# EAGLE design board (EAGLE 8.0.0)
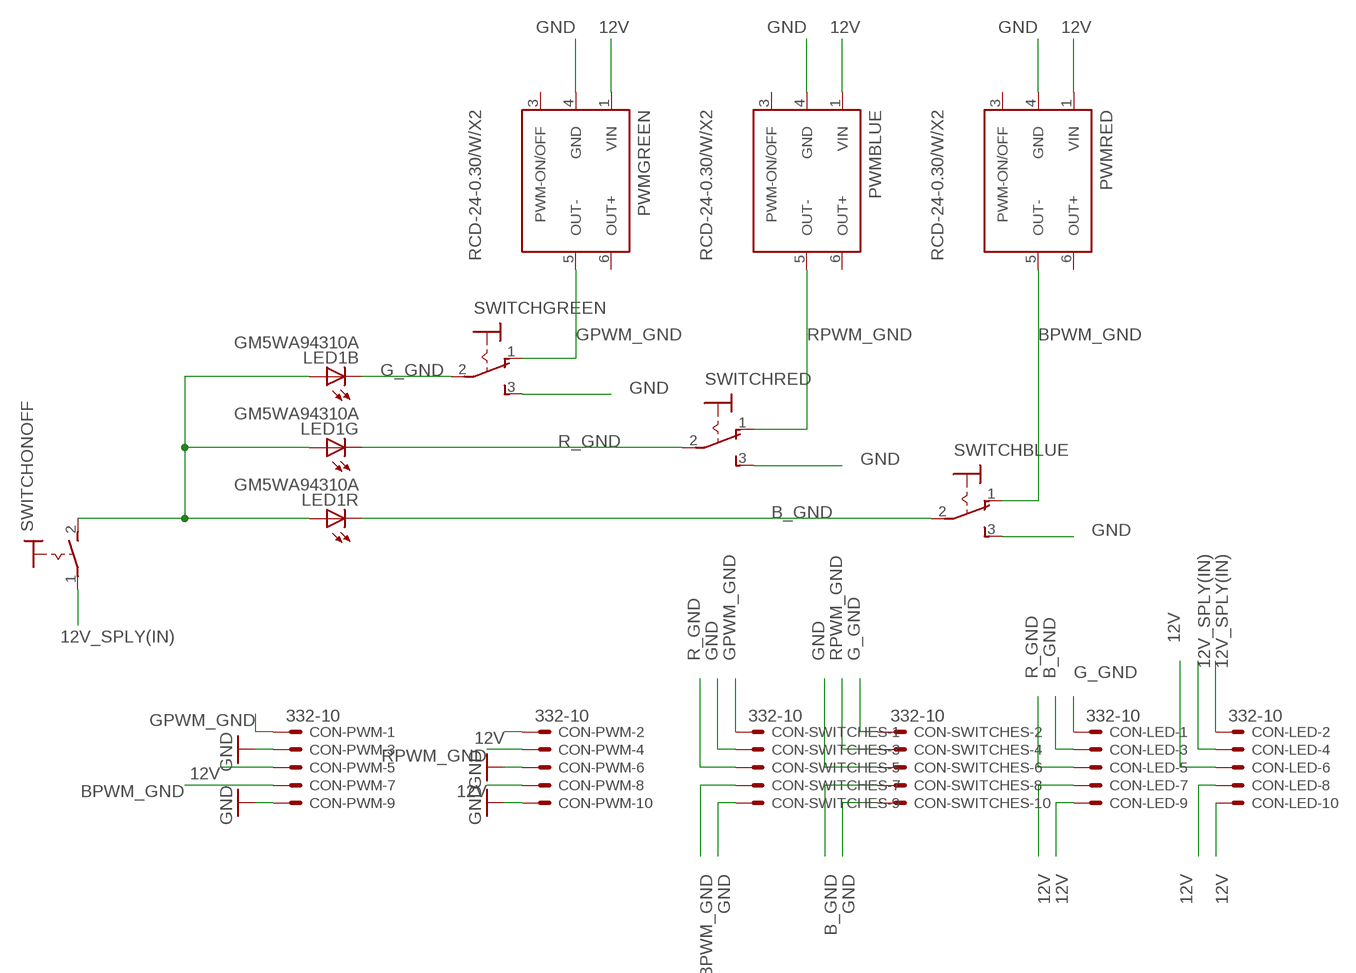
[diagram p0: schematic, sheet 1]

## Parts
CON-LED  332-10  [332-10]
CON-PWM  332-10  [332-10]
CON-SWITCHES  332-10  [332-10]
LED1  GM5WA94310A  [GM5WA94310A]
PWMBLUE  RCD-24-0.30/W/X2  [RCD-24/W/X2]
PWMGREEN  RCD-24-0.30/W/X2  [RCD-24/W/X2]
PWMRED  RCD-24-0.30/W/X2  [RCD-24/W/X2]
SWITCHBLUE  M9040P  [M9040P]
SWITCHGREEN  M9040P  [M9040P]
SWITCHONOFF  MS243  [MS243]
SWITCHRED  M9040P  [M9040P]

## Nets
12V: CON-LED.6 CON-LED.7 CON-LED.8 CON-LED.9 CON-LED.10 CON-PWM.2 CON-PWM.5 CON-PWM.8 LED1.1(B:A) LED1.2(R:A) LED1.3(G:A) PWMBLUE.1(VIN) PWMGREEN.1(VIN) PWMRED.1(VIN) SWITCHONOFF.2(S)
12V_SPLY(IN): CON-LED.2 CON-LED.4 SWITCHONOFF.1(P)
B_GND: CON-LED.3 CON-SWITCHES.8 LED1.5(R:C) SWITCHBLUE.2(P)
BPWM_GND: CON-PWM.7 CON-SWITCHES.7 PWMRED.5(OUT-) SWITCHBLUE.1(O)
G_GND: CON-LED.1 CON-SWITCHES.2 LED1.6(B:C) SWITCHGREEN.2(P)
GND: CON-PWM.3 CON-PWM.6 CON-PWM.9 CON-PWM.10 CON-SWITCHES.3 CON-SWITCHES.6 CON-SWITCHES.9 CON-SWITCHES.10 PWMBLUE.4(GND) PWMGREEN.4(GND) PWMRED.4(GND) SWITCHBLUE.3(S) SWITCHGREEN.3(S) SWITCHRED.3(S)
GPWM_GND: CON-PWM.1 CON-SWITCHES.1 PWMGREEN.5(OUT-) SWITCHGREEN.1(O)
R_GND: CON-LED.5 CON-SWITCHES.5 LED1.4(G:C) SWITCHRED.2(P)
RPWM_GND: CON-PWM.4 CON-SWITCHES.4 PWMBLUE.5(OUT-) SWITCHRED.1(O)
Unconnected: PWMBLUE.3(PWM-ON/OFF) PWMBLUE.6(OUT+) PWMGREEN.3(PWM-ON/OFF) PWMGREEN.6(OUT+) PWMRED.3(PWM-ON/OFF) PWMRED.6(OUT+)

## Library data of the parts
CON-LED CON-PWM CON-SWITCHES = con-garry:332-10: 10 Pin - 2mm Dual Row Source: www.mpe-connector.de / garry_shortform_2012.pdf
LED1 = led:GM5WA94310A: Chip LED RGB Source: http://document.sharpsma.com/files/GM5WA94310A_SS.pdf
PWMBLUE PWMGREEN PWMRED = recom-international:RCD-24*/W/X2: Constant Current Output LED Driver PWM ON/OFF Source: http://www.recom-international.de/pdf/Innoline/RCD-24.pdf; OC_FARNELL: unknown; OC_NEWARK: unknown
SWITCHBLUE SWITCHGREEN SWITCHRED = switch:M9040P: TOGGLE SWITCH Marquardt
SWITCHONOFF = switch:MS243: TOGGLE SWITCH

## Board
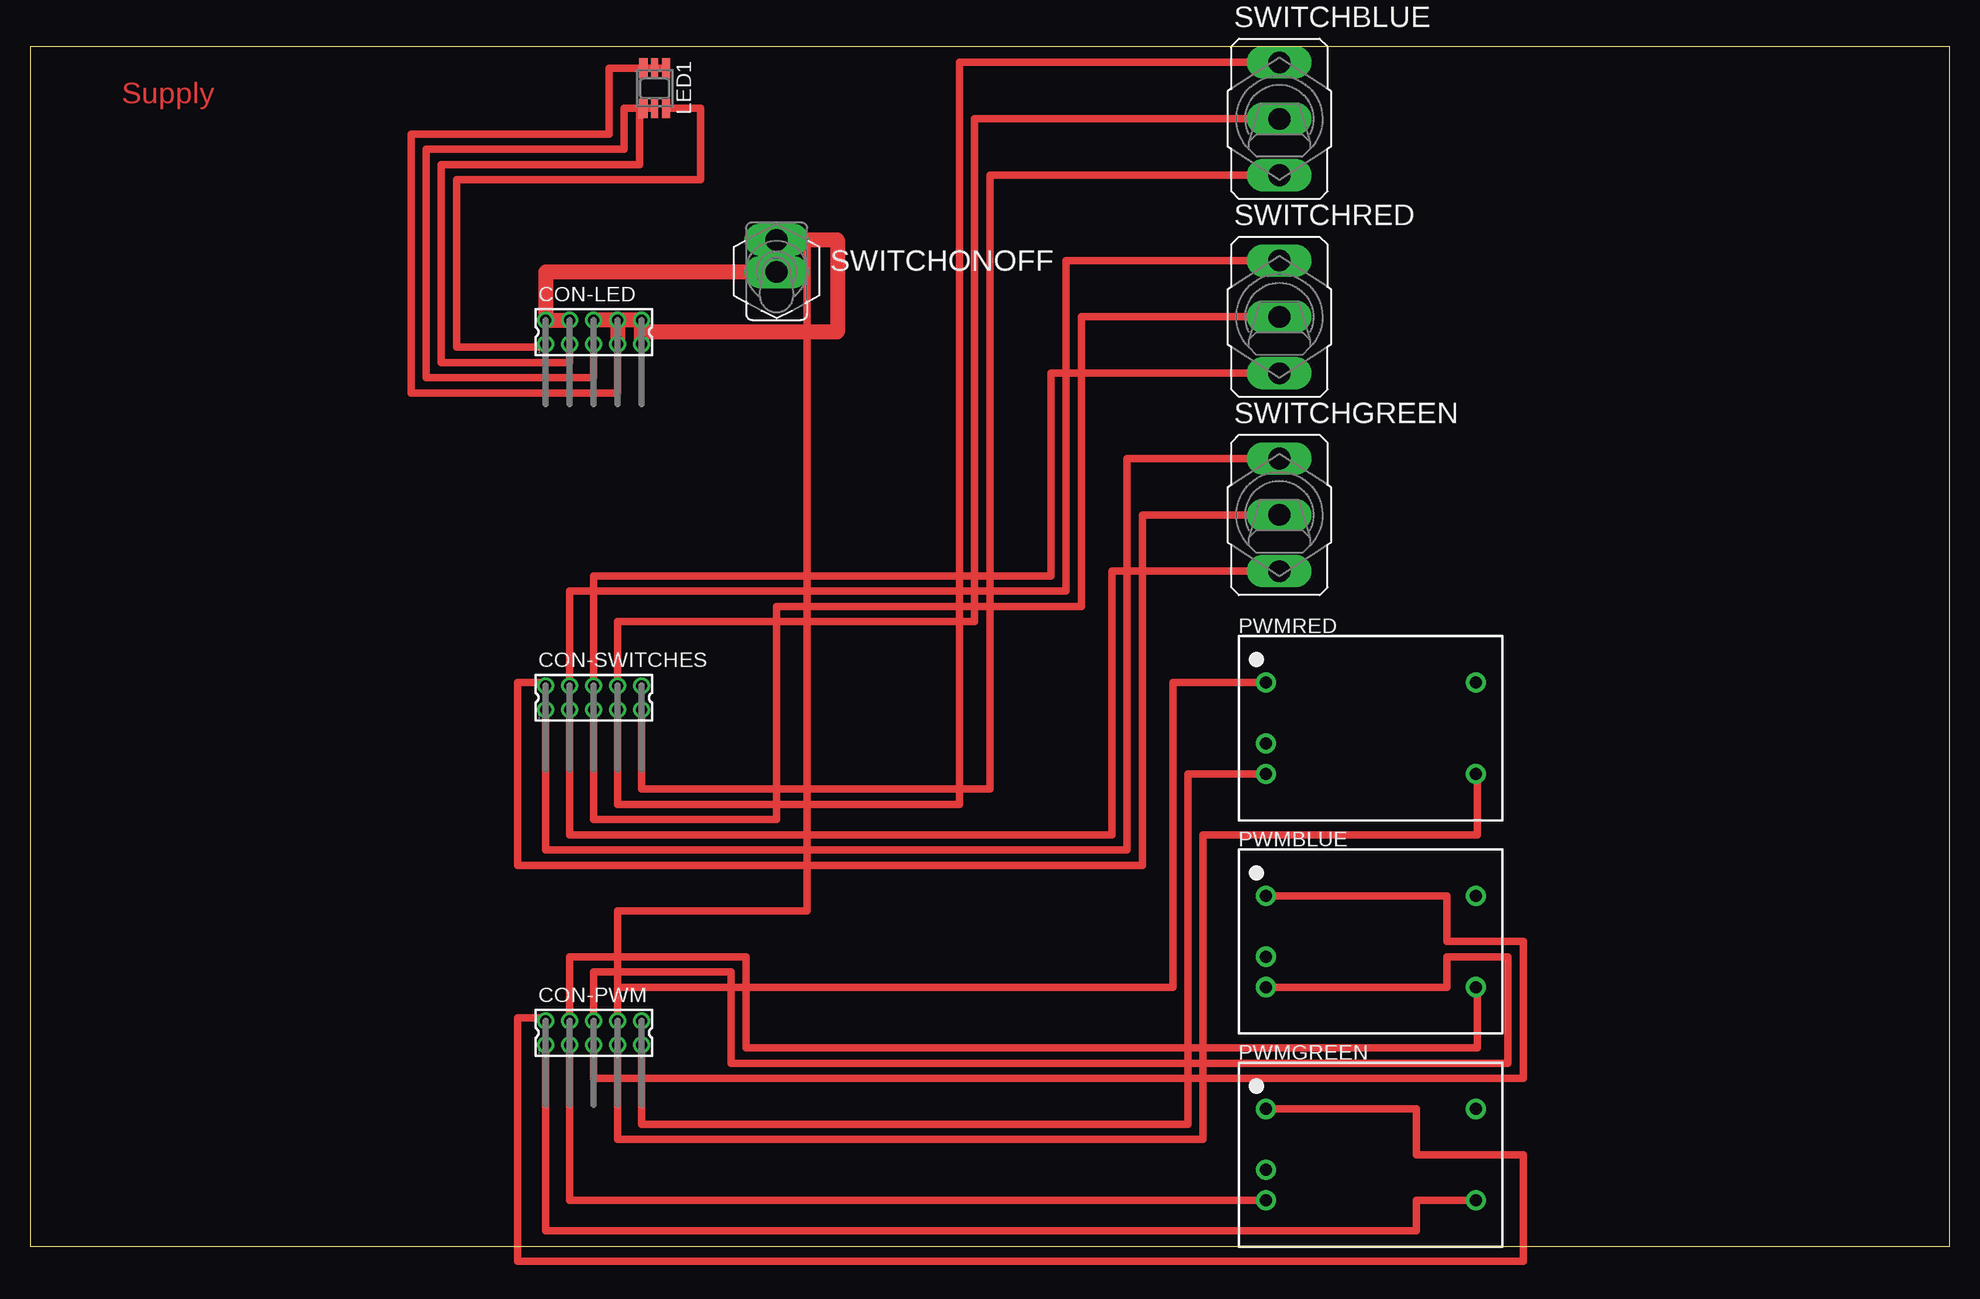
[diagram p1: board, top side]
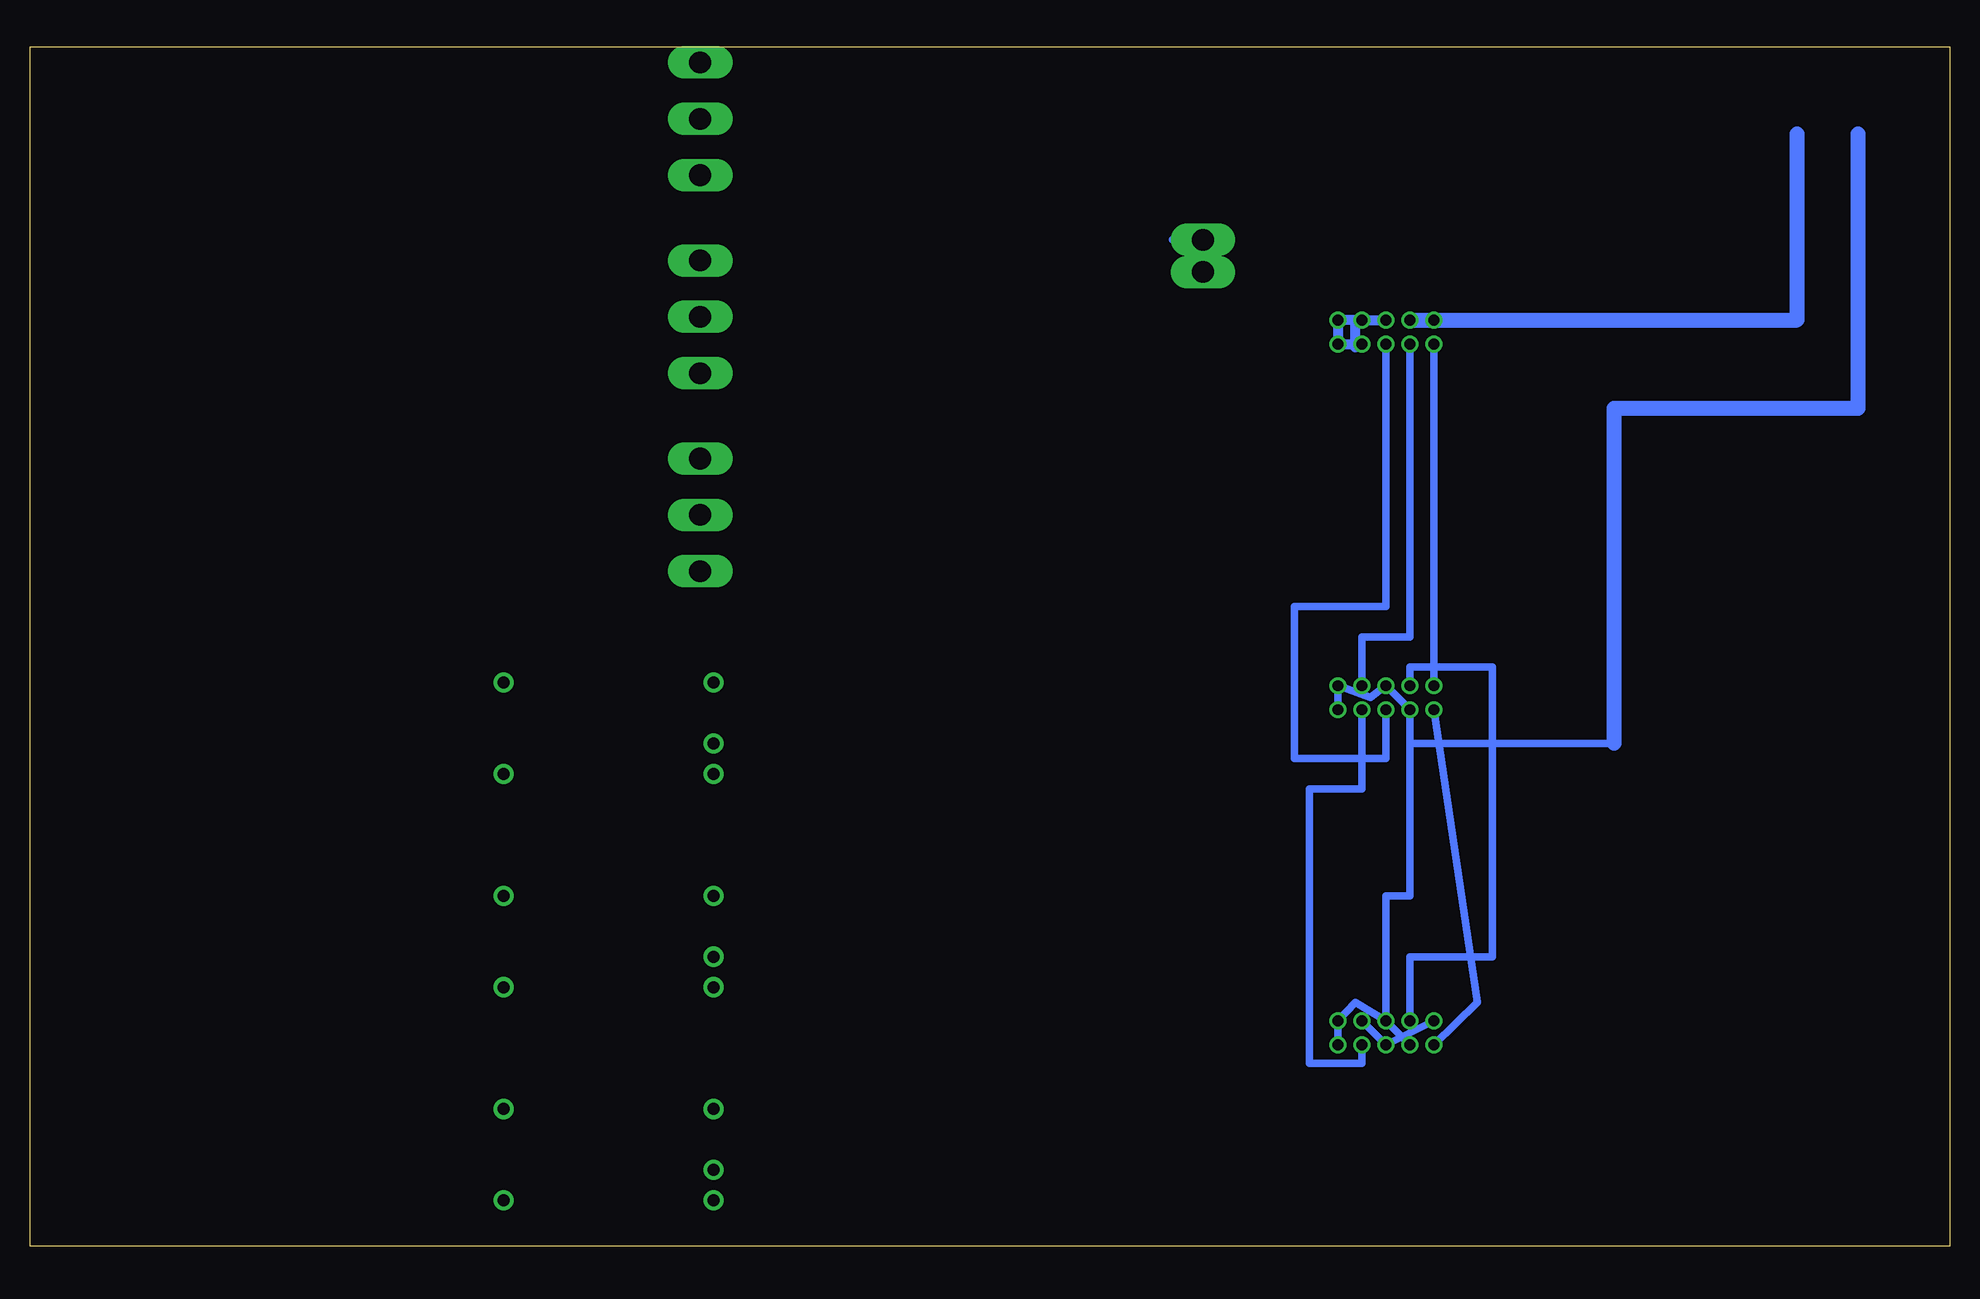
[diagram p2: board, bottom side, seen from below]

Size 160 x 100 mm. Coordinates in mm from the lower left corner, seen from the top.
Outline: 0,0 160,0 160,100 0,100 0,0
Copper layers (1*16): Top 0.035mm / dielectric 1.5mm / Bottom 0.035mm
Design rules "default": minimum track width 10mil, minimum drill 24mil, track to track 8mil, track to pad 8mil, pad to pad 8mil, via to via 8mil, smd to smd 8mil, copper to edge 40mil, drill to drill 8mil, minimum pad ring 10mil, minimum via ring 8mil, stop-mask expansion 4mil, vias tented up to drill 0mil, thermal gap 10mil

### Footprints (pad centres in the part's own frame; a part is rotated, then mirrored left to right if it is on the bottom)
332-10 = drill 0.9 pad 1.27: 1 -4,-1; 2 -4,1; 3 -2,-1; 4 -2,1; 5 0,-1; 6 0,1; 7 2,-1; 8 2,1; 9 4,-1; 10 4,1
GM5WA94310A = smd 0.7 x 1.65: 1 -0.95,-1.675; 3 0.95,-1.675; 4 0.95,1.675; 6 -0.95,1.675 | smd 0.6 x 1.65: 2 0,-1.675; 5 0,1.675
RCD-24/W/X2 = drill 1 pad 1.676: 1 -8.75,3.81; 3 -8.75,-1.27; 4 -8.75,-3.81; 5 8.75,-3.81; 6 8.75,3.81
M9040P = drill 1.803 long: 1 0,4.699; 2 0,0; 3 0,-4.699
MS243 = drill 1.803 pad 2 long: 1 0,-1.346; 2 0,1.346

### Placement (x,y rotation side)
CON-LED  46.99,76.2 0 top
CON-PWM  46.99,17.78 0 top
CON-SWITCHES  46.99,45.72 0 top
LED1  52.07,96.52 180 top
PWMBLUE  111.76,25.4 0 top
PWMGREEN  111.76,7.62 0 top
PWMRED  111.76,43.18 0 top
SWITCHBLUE  104.14,93.98 0 top
SWITCHGREEN  104.14,60.96 0 top
SWITCHONOFF  62.23,82.55 0 top
SWITCHRED  104.14,77.47 0 top

### Tracks (layer width: path | path; a pad name or v marks a point on that pad's centre or on a via)
12V
  Top 0.61: PWMGREEN.1 115.57,11.43 115.57,7.62 124.46,7.62 124.46,-1.27 40.64,-1.27 40.64,19.05 42.99,19.05 CON-PWM.2 | PWMBLUE.1 118.11,29.21 118.11,25.4 124.46,25.4 124.46,13.97 46.99,13.97 CON-PWM.5 | PWMRED.1 95.25,46.99 95.25,21.59 48.99,21.59 CON-PWM.8 48.99,27.94 64.77,27.94 64.77,83.9 | CON-LED.7 48.99,71.12 31.75,71.12 31.75,92.71 48.26,92.71 48.26,98.19 LED1.3 LED1.2 LED1.1
  Top 1.27: SWITCHONOFF.2 67.31,83.9 67.31,76.2 50.99,76.2 CON-LED.9 CON-LED.10 CON-LED.8 | CON-LED.8 CON-LED.6 | CON-LED.8 CON-LED.7
  Bottom 0.61: 64.77,83.9 SWITCHONOFF.2 | CON-PWM.8 CON-PWM.5 CON-PWM.2
  Bottom 0.813: 49.53,77.2 CON-LED.6 | 49.53,77.2 CON-LED.10 CON-LED.9 49.53,75.2 | 49.53,75.2 49.53,74.93 | 49.53,75.2 49.53,77.2
12V_SPLY(IN)
  Top 1.27: SWITCHONOFF.1 42.99,81.2 CON-LED.2 CON-LED.4
  Bottom 1.27: CON-LED.4 12.7,77.2 12.7,92.71
B_GND
  Top 0.61: SWITCHBLUE.2 78.74,93.98 78.74,52.07 48.99,52.07 CON-SWITCHES.8 | LED1.5 50.8,94.84 50.8,90.17 34.29,90.17 34.29,73.66 44.99,73.66 CON-LED.3
  Bottom 0.61: CON-LED.3 44.99,50.8 48.99,50.8 CON-SWITCHES.8
BPWM_GND
  Top 0.61: PWMRED.5 120.65,39.37 120.65,34.29 97.79,34.29 97.79,8.89 48.99,8.89 CON-PWM.7 | SWITCHBLUE.1 77.47,98.68 77.47,36.83 48.99,36.83 CON-SWITCHES.7
  Bottom 0.61: CON-PWM.7 48.99,15.24 53.34,15.24 53.34,38.1 48.99,38.1 CON-SWITCHES.7
G_GND
  Top 0.61: SWITCHGREEN.2 92.71,60.96 92.71,31.75 40.64,31.75 40.64,46.99 42.99,46.99 CON-SWITCHES.2 | LED1.6 55.88,94.84 55.88,88.9 35.56,88.9 35.56,74.93 42.99,74.93 CON-LED.1
  Bottom 0.61: CON-LED.1 CON-SWITCHES.2
GND
  Top 0.61: PWMGREEN.4 44.99,3.81 CON-PWM.3 | PWMBLUE.4 118.11,21.59 118.11,24.13 123.19,24.13 123.19,15.24 58.42,15.24 58.42,22.86 46.99,22.86 CON-PWM.6 | PWMRED.4 96.52,39.37 96.52,10.16 50.99,10.16 CON-PWM.9 | SWITCHGREEN.3 90.17,56.26 90.17,34.29 44.99,34.29 CON-SWITCHES.3 | SWITCHRED.3 85.09,72.77 85.09,55.88 46.99,55.88 CON-SWITCHES.6 | SWITCHBLUE.3 80.01,89.28 80.01,38.1 50.99,38.1 CON-SWITCHES.9
  Bottom 0.61: CON-SWITCHES.9 CON-SWITCHES.10 48.26,45.72 CON-SWITCHES.6 CON-SWITCHES.3 | CON-SWITCHES.3 44.99,41.91 27.94,41.91 | CON-PWM.6 46.99,29.21 44.99,29.21 CON-SWITCHES.3 | CON-PWM.9 CON-PWM.10 49.53,20.32 CON-PWM.6 | CON-PWM.3 CON-PWM.6
  Bottom 1.27: 27.94,41.91 27.94,69.85 7.62,69.85 7.62,92.71
GPWM_GND
  Top 0.61: PWMGREEN.5 115.57,3.81 115.57,1.27 42.99,1.27 CON-PWM.1 | SWITCHGREEN.1 91.44,65.66 91.44,33.02 42.99,33.02 CON-SWITCHES.1
  Bottom 0.61: CON-PWM.1 39.37,20.32 CON-SWITCHES.1
R_GND
  Top 0.61: SWITCHRED.2 87.63,77.47 87.63,53.34 62.23,53.34 62.23,35.56 46.99,35.56 CON-SWITCHES.5 | LED1.4 49.53,94.84 49.53,91.44 33.02,91.44 33.02,72.39 46.99,72.39 CON-LED.5
  Bottom 0.61: CON-LED.5 46.99,53.34 54.61,53.34 54.61,40.64 46.99,40.64 CON-SWITCHES.5
RPWM_GND
  Top 0.61: PWMBLUE.5 120.65,21.59 120.65,16.51 59.69,16.51 59.69,24.13 44.99,24.13 CON-PWM.4 | SWITCHRED.1 86.36,82.17 86.36,54.61 44.99,54.61 CON-SWITCHES.4
  Bottom 0.61: CON-SWITCHES.4 44.99,48.26 38.1,48.26 38.1,24.13 44.99,24.13 CON-PWM.4

### Text on the board
Top: Supply